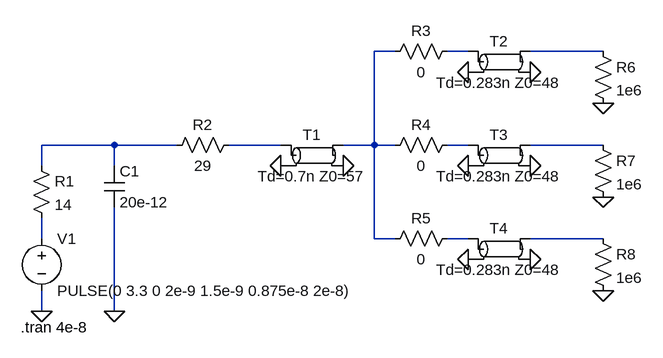
[diagram p0: schematic Star.asc]
Star.asc, the LTspice schematic file:
Version 4
SHEET 1 880 680
WIRE 464 -128 432 -128
WIRE 576 -128 544 -128
WIRE 784 -128 672 -128
WIRE 32 16 -80 16
WIRE 128 16 32 16
WIRE 288 16 208 16
WIRE 432 16 432 -128
WIRE 432 16 384 16
WIRE 464 16 432 16
WIRE 576 16 544 16
WIRE 784 16 672 16
WIRE -80 48 -80 16
WIRE 32 48 32 16
WIRE -80 160 -80 128
WIRE 432 160 432 16
WIRE 464 160 432 160
WIRE 576 160 544 160
WIRE 784 160 672 160
WIRE -80 272 -80 240
WIRE 32 272 32 112
FLAG -80 272 0
FLAG 32 272 0
FLAG 576 -96 0
FLAG 672 -96 0
FLAG 576 48 0
FLAG 672 48 0
FLAG 576 192 0
FLAG 672 192 0
FLAG 288 48 0
FLAG 384 48 0
FLAG 784 -48 0
FLAG 784 96 0
FLAG 784 240 0
SYMBOL voltage -80 144 R0
WINDOW 123 0 0 Left 0
WINDOW 39 0 0 Left 0
SYMATTR InstName V1
SYMATTR Value PULSE(0 3.3 0 2e-9 1.5e-9 0.875e-8 2e-8)
SYMBOL res -96 32 R0
SYMATTR InstName R1
SYMATTR Value 14
SYMBOL cap 16 48 R0
SYMATTR InstName C1
SYMATTR Value 20e-12
SYMBOL res 224 0 R90
WINDOW 0 0 56 VBottom 2
WINDOW 3 32 56 VTop 2
SYMATTR InstName R2
SYMATTR Value 29
SYMBOL tline 336 32 R0
SYMATTR InstName T1
SYMATTR Value Td=0.7n Z0=57
SYMBOL tline 624 -112 R0
SYMATTR InstName T2
SYMATTR Value Td=0.283n Z0=48
SYMBOL tline 624 32 R0
SYMATTR InstName T3
SYMATTR Value Td=0.283n Z0=48
SYMBOL tline 624 176 R0
SYMATTR InstName T4
SYMATTR Value Td=0.283n Z0=48
SYMBOL res 560 -144 R90
WINDOW 0 0 56 VBottom 2
WINDOW 3 32 56 VTop 2
SYMATTR InstName R3
SYMATTR Value 0
SYMBOL res 560 0 R90
WINDOW 0 0 56 VBottom 2
WINDOW 3 32 56 VTop 2
SYMATTR InstName R4
SYMATTR Value 0
SYMBOL res 560 144 R90
WINDOW 0 0 56 VBottom 2
WINDOW 3 32 56 VTop 2
SYMATTR InstName R5
SYMATTR Value 0
SYMBOL res 768 -144 R0
SYMATTR InstName R6
SYMATTR Value 1e6
SYMBOL res 768 0 R0
SYMATTR InstName R7
SYMATTR Value 1e6
SYMBOL res 768 144 R0
SYMATTR InstName R8
SYMATTR Value 1e6
TEXT -112 296 Left 2 !.tran 4e-8

The netlist it stands for:
* Star.asc
V1 N008 0 PULSE(0 3.3 0 2e-9 1.5e-9 0.875e-8 2e-8)
R1 N004 N008 14
C1 N004 0 20e-12
R2 N005 N004 29
T1 N005 0 N001 0 Td=0.7n Z0=57
T2 N002 0 N003 0 Td=0.283n Z0=48
T3 N006 0 N007 0 Td=0.283n Z0=48
T4 N009 0 N010 0 Td=0.283n Z0=48
R3 N002 N001 0
R4 N006 N001 0
R5 N009 N001 0
R6 N003 0 1e6
R7 N007 0 1e6
R8 N010 0 1e6
.tran 4e-8
.backanno
.end